# EAGLE design sensie (EAGLE 6.4)
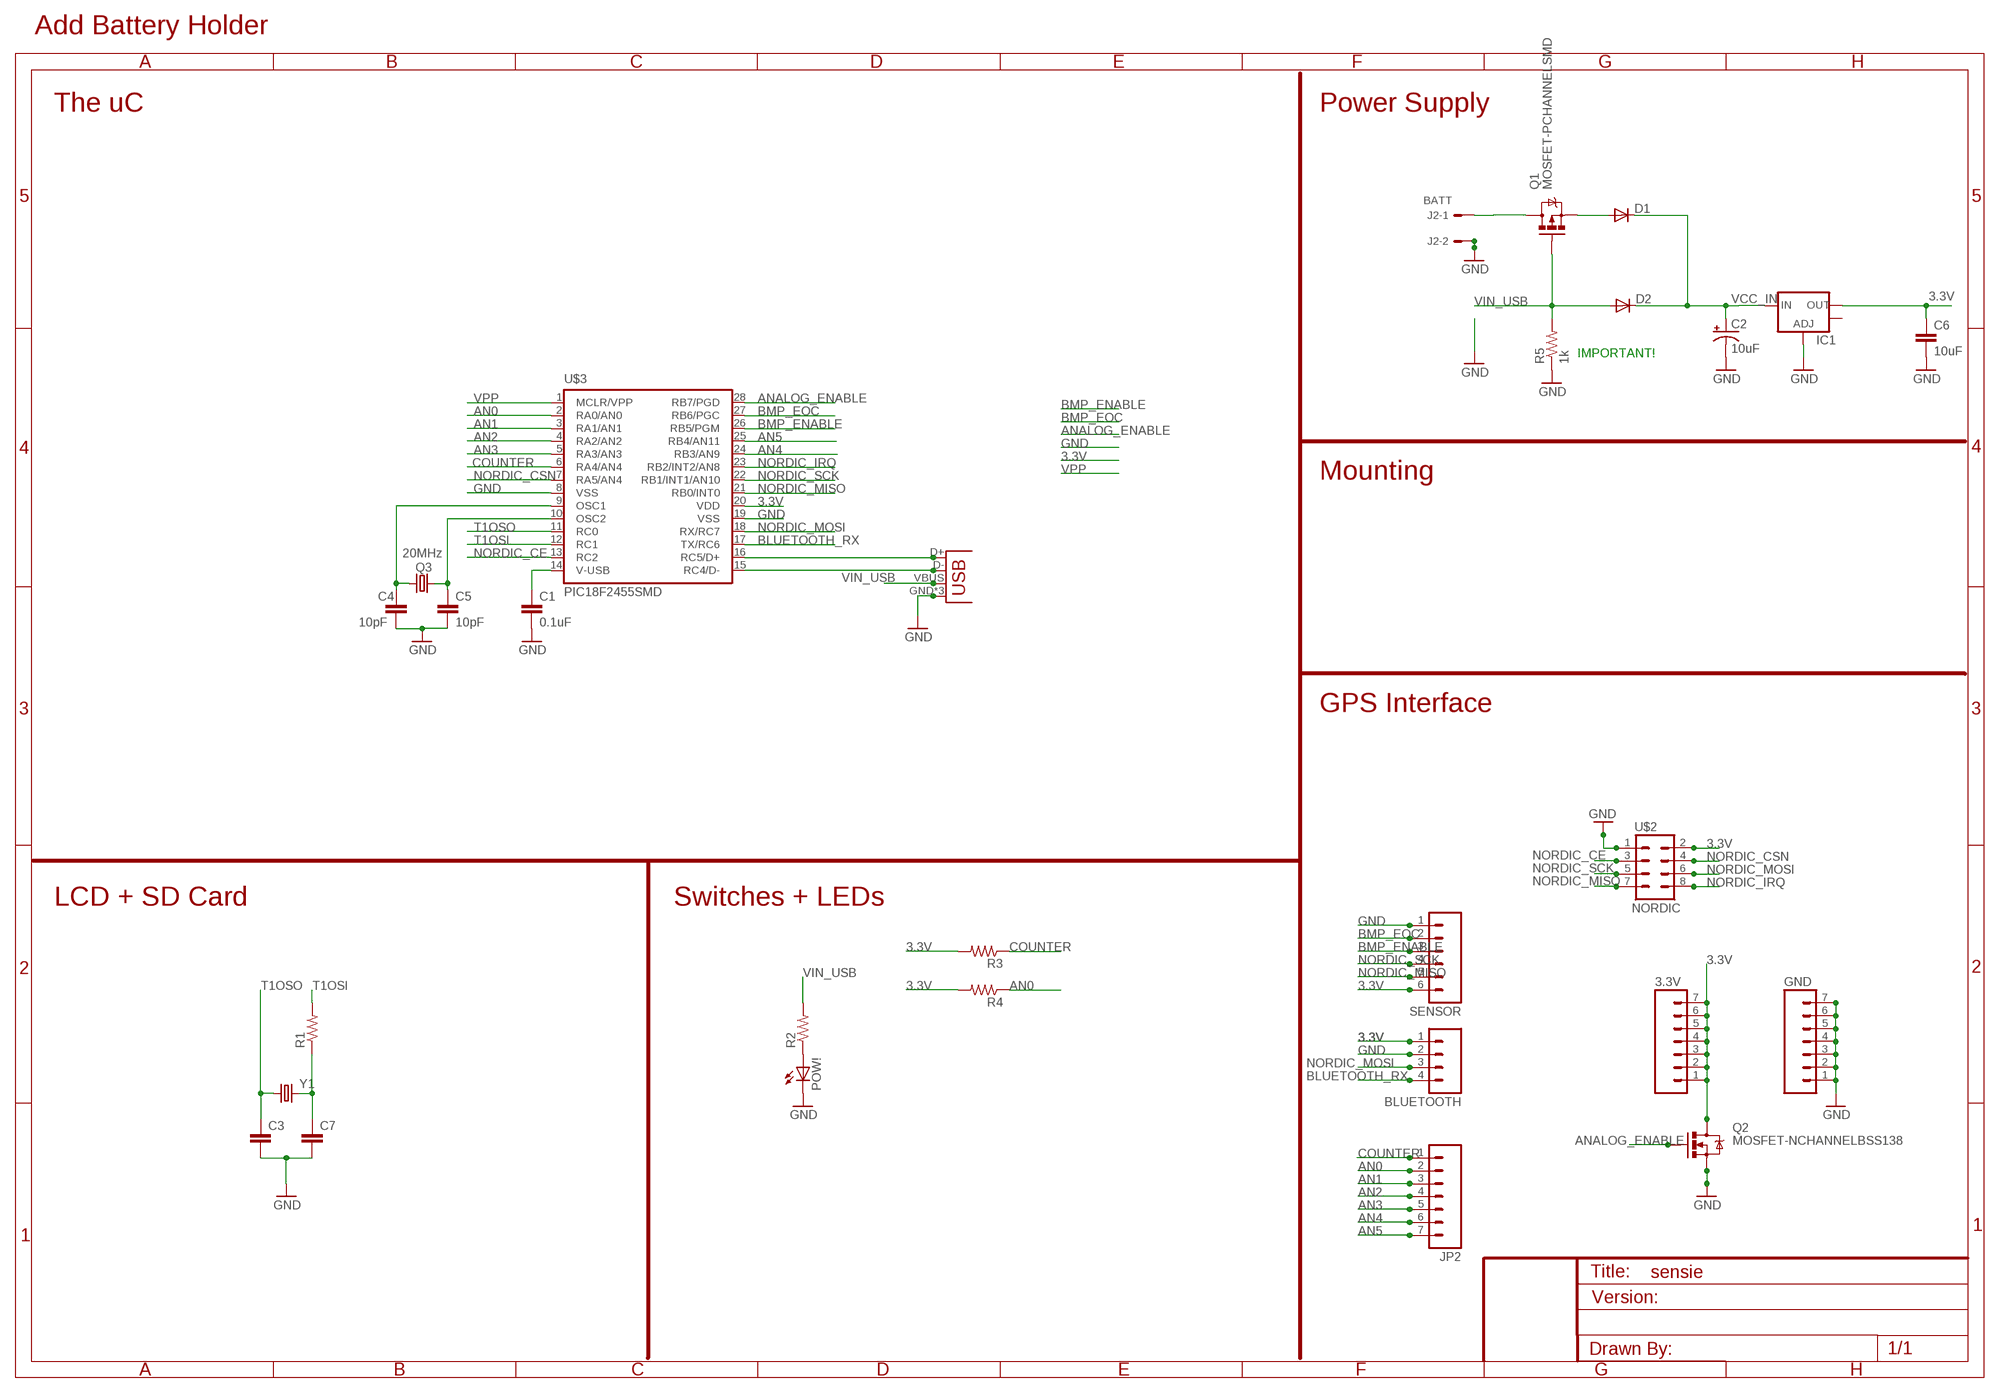
[diagram p0: schematic, sheet 1]

## Parts
3.3V  M07  [1X07]
BLUETOOTH  M04PTH  [1X04]
C1  0.1uF  CAP0805  [0805]
C2  10uF  CAP_POL3528  [EIA3528]
C3  CAP0603-CAP  [0603-CAP]
C4  10pF  CAP0805  [0805]
C5  10pF  CAP0805  [0805]
C6  10uF  CAPSMD  [GRM43D]
C7  CAP0603-CAP  [0603-CAP]
D1  DIODESOD  [SOD-323]
D2  DIODESOD  [SOD-323]
GND  M07  [1X07]
IC1  V_REG_LM1117SOT223  [SOT223]
J2  BATT  JST-PH-2-BS  [B2B-PH-K-S]
JP2  M07  [1X07]
JP3  USB-MICROB  [USB-MICROB]
POW!  LED0603  [LED-0603]
Q1  MOSFET-PCHANNELSMD  [SOT23-3]
Q2  MOSFET-NCHANNELBSS138  [SOT23]
Q3  20MHz  CRYSTALSMD  [HC49UP]
R1  RESISTOR0603-RES  [0603-RES]
R2  RESISTOR0603-RES  [0603-RES]
R3  RESISTOR0603-RES  [0603-RES]
R4  RESISTOR0603-RES  [0603-RES]
R5  1k  RESISTOR  [0805]
SENSOR  M06SIP  [1X06]
U$2  NORDIC  M04X2  [2X4]
U$3  PIC18F2455SMD  [SO-28W]
Y1  CRYSTAL32-SMD  [CRYSTAL-32KHZ-SMD]

## Nets
3.3V: 3.3V.1 3.3V.2 3.3V.3 3.3V.4 3.3V.5 3.3V.6 3.3V.7 BLUETOOTH.1 C6.A IC1.2(OUT) Q2.3(D) R3.2 R4.2 SENSOR.6 U$2.2 U$3.20(VDD)
AN0: JP2.2 R4.1 U$3.2(RA0/AN0)
AN1: JP2.3 U$3.3(RA1/AN1)
AN2: JP2.4 U$3.4(RA2/AN2)
AN3: JP2.5 U$3.5(RA3/AN3)
AN4: JP2.6 U$3.24(RB3/AN9)
AN5: JP2.7 U$3.25(RB4/AN11)
ANALOG_ENABLE: Q2.1(G) U$3.28(RB7/PGD)
BLUETOOTH_RX: BLUETOOTH.4 U$3.17(TX/RC6)
BMP_ENABLE: SENSOR.3 U$3.26(RB5/PGM)
BMP_EOC: SENSOR.2 U$3.27(RB6/PGC)
COUNTER: JP2.1 R3.1 U$3.6(RA4/AN4)
GND: BLUETOOTH.2 C1.2 C2.C(-) C3.2 C4.2 C5.2 C6.C C7.2 GND.1 GND.2 GND.3 GND.4 GND.5 GND.6 GND.7 IC1.1(ADJ) J2.2 JP3.GND JP3.P$3(GND) JP3.P$4(GND) POW!.C Q2.2(S) R5.1 SENSOR.1 U$2.1 U$3.8(VSS) U$3.19(VSS)
N$2: C1.1 U$3.14(V-USB)
N$3: POW!.A R2.1
N$8: C7.1 R1.1 Y1.X2
N$10: C5.1 Q3.2 U$3.10(OSC2)
N$11: C4.1 Q3.1 U$3.9(OSC1)
N$14: JP3.D+ U$3.16(RC5/D+)
N$15: JP3.D- U$3.15(RC4/D-)
N$19: D1.2(A) Q1.2(S)
NORDIC_CE: U$2.3 U$3.13(RC2)
NORDIC_CSN: U$2.4 U$3.7(RA5/AN4)
NORDIC_IRQ: U$2.8 U$3.23(RB2/INT2/AN8)
NORDIC_MISO: SENSOR.5 U$2.7 U$3.21(RB0/INT0)
NORDIC_MOSI: BLUETOOTH.3 U$2.6 U$3.18(RX/RC7)
NORDIC_SCK: SENSOR.4 U$2.5 U$3.22(RB1/INT1/AN10)
T1OSI: R1.2 U$3.12(RC1)
T1OSO: C3.1 U$3.11(RC0) Y1.X1
VCC_IN: C2.A(+) D1.1(C) D2.1(C) IC1.3(IN)
VIN_BATT: J2.1 Q1.3(D)
VIN_USB: D2.2(A) JP3.VBUS Q1.1(G) R2.2 R5.2
VPP: U$3.1(MCLR/VPP)
Unconnected: IC1.4(OUT)

## Notes on the sheet
- Add Battery Holder
- The uC | Power Supply
- IMPORTANT!
- Mounting
- GPS Interface
- LCD + SD Card | Switches + LEDs

## Library data of the parts
3.3V GND JP2 = SparkFun-Connectors:M07: Header 7 Standard 7-pin 0.1" header. Use with straight break away headers (SKU : PRT-00116), right angle break away headers (PRT-00553), swiss pins (PRT-00743), machine pins (PRT-00117), and female headers (PRT-00115). NOTES ON THE VARIANTS LOCK and LOCK_LONGPADS... This footprint was designed to help hold the alignment of a through-hole component (i.e. 7-pin header) while soldering it into place. You may notice that each hole has been shifted either up or down by 0.005 of an inch from it's more standard position (which is usually a perfectly straight line). This slight alteration caused the pins (the squares in the middle) to touch the edges of the holes. Because they are alternating, it causes a "brace" to hold the header in place. 0.005 has proven to be the perfect amount of "off-center" position when using our standard breakaway headers. Although looks a little odd when you look at the bare footprint, once you have a header in there, the alteration is very hard to notice. Also, if you push a header all the way into place, it is covered up entirely on the bottom side. This idea of altering the position of holes to aid alignment will be further integrated into the Sparkfun Library for other footprints. It can help hold any component with 3 or more connection pins.
BLUETOOTH = SparkFun-Connectors:M04: Header 4 Standard 4-pin 0.1" header. Use with straight break away headers (SKU : PRT-00116), right angle break away headers (PRT-00553), swiss pins (PRT-00743), machine pins (PRT-00117), and female headers (PRT-00115). Molex polarized connector foot print use with SKU : PRT-08231 with associated crimp pins and housings. 1MM SMD Version SKU: PRT-10208
C1 C4-C6 = SparkFun:CAP: Capacitor Standard 0603 ceramic capacitor, and 0.1" leaded capacitor.
C2 = SparkFun:CAP_POL: Capacitor Polarized These are standard SMD and PTH capacitors. Normally 10uF, 47uF, and 100uF in electrolytic and tantalum varieties. Always verify the external diameter of the through hole cap, it varies with capacity, voltage, and manufacturer. The EIA devices should be standard.
C3 C7 = SparkFun-Passives:CAP: Capacitor Standard 0603 ceramic capacitor, and 0.1" leaded capacitor.
D1 D2 = SparkFun-DiscreteSemi:DIODE: Diode These are standard reverse protection diodes and small signal diodes. SMA package can handle up to about 1A. SOD-323 can handle about 200mA. What the SOD-323 package when ordering, there are some mfgs out there that are 5-pin packages.
IC1 = SparkFun-PowerIC:V_REG_LM1117: Voltage Regulator LM1117 Standard adjustable voltage regulator but in SMD form. Spark Fun Electronics SKU : COM-00595
J2 = pcb_libraries_con-jst-ph:JST-PH-2
JP3 = bafoontecha:USB: USB Connectors USB-B-PTH is fully proven SKU : PRT-00139/CONN-08278 USB-miniB is fully proven SKU : PRT-00587 USB-A-PCB is untested. USB-A-H is throughly reviewed, but untested. Spark Fun Electronics SKU : PRT-00437 USB-B-SMT is throughly reviewed, but untested. Needs silkscreen touching up. USB-A-S has not been used/tested USB-MB-H has not been used/tested USB-MICROB has been used. CONN-09505; PROD_ID: CONN-09505
POW! = SparkFun-LED:LED: LEDs Standard schematic elements and footprints for 5mm, 3mm, 1206, and 0603 sized LEDs. 5mm - Spark Fun Electronics SKU : COM-00529 (and others)
Q1 = SparkFun-DiscreteSemi:MOSFET-PCHANNEL: Generic PMOSFET
Q2 = SparkFun-DiscreteSemi:MOSFET-NCHANNEL: Common NMOSFET Parts MFG P/N Store ID Prod ID FDD8780 TRANS-09984 SI7820DN TRANS-11055 FDS6630A IC-08089 2N7002PW TRANS-11151 FQP30N06L COM-10213 TRANS-10060 BSS123LT1G TRANS-08345 BSS138 TRANS-00830 BS170 2N7000; PROD_ID: TRANS-00830
Q3 = SparkFun:CRYSTAL: Crystals Various standard crystals. Proven footprints. Spark Fun Electronics SKU : COM-00534
R1-R4 = SparkFun-Passives:RESISTOR: Resistor
R5 = SparkFun:RESISTOR: Resistor
SENSOR = SparkFun-Connectors:M06: Header 6 Standard 6-pin 0.1" header. Use with straight break away headers (SKU : PRT-00116), right angle break away headers (PRT-00553), swiss pins (PRT-00743), machine pins (PRT-00117), and female headers (PRT-00115). Molex polarized connector foot print use with SKU : PRT-08094 with associated crimp pins and housings. NOTES ON THE VARIANTS LOCK and LOCK_LONGPADS... This footprint was designed to help hold the alignment of a through-hole component (i.e. 6-pin header) while soldering it into place. You may notice that each hole has been shifted either up or down by 0.005 of an inch from it's more standard position (which is a perfectly straight line). This slight alteration caused the pins (the squares in the middle) to touch the edges of the holes. Because they are alternating, it causes a "brace" to hold the component in place. 0.005 has proven to be the perfect amount of "off-center" position when using our standard breakaway headers. Although looks a little odd when you look at the bare footprint, once you have a header in there, the alteration is very hard to notice. Also,if you push a header all the way into place, it is covered up entirely on the bottom side. This idea of altering the position of holes to aid alignment will be further integrated into the Sparkfun Library for other footprints. It can help hold any component with 3 or more connection pins.
U$2 = SparkFun-Connectors:M04X2: .1" header, two rows of four.
U$3 = SparkFun:PIC18F2455
Y1 = SparkFun-FreqCtrl:CRYSTAL: Various standard crystals. Proven footprints. Spark Fun Electronics SKU : COM-00534

## Board
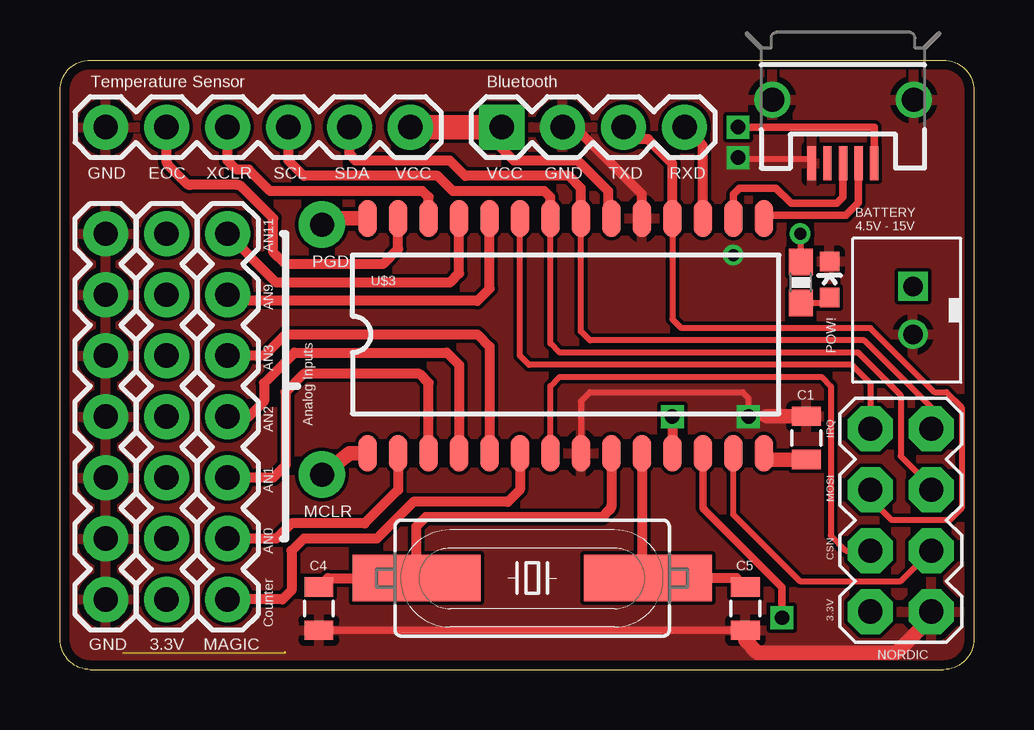
[diagram p1: board, top side]
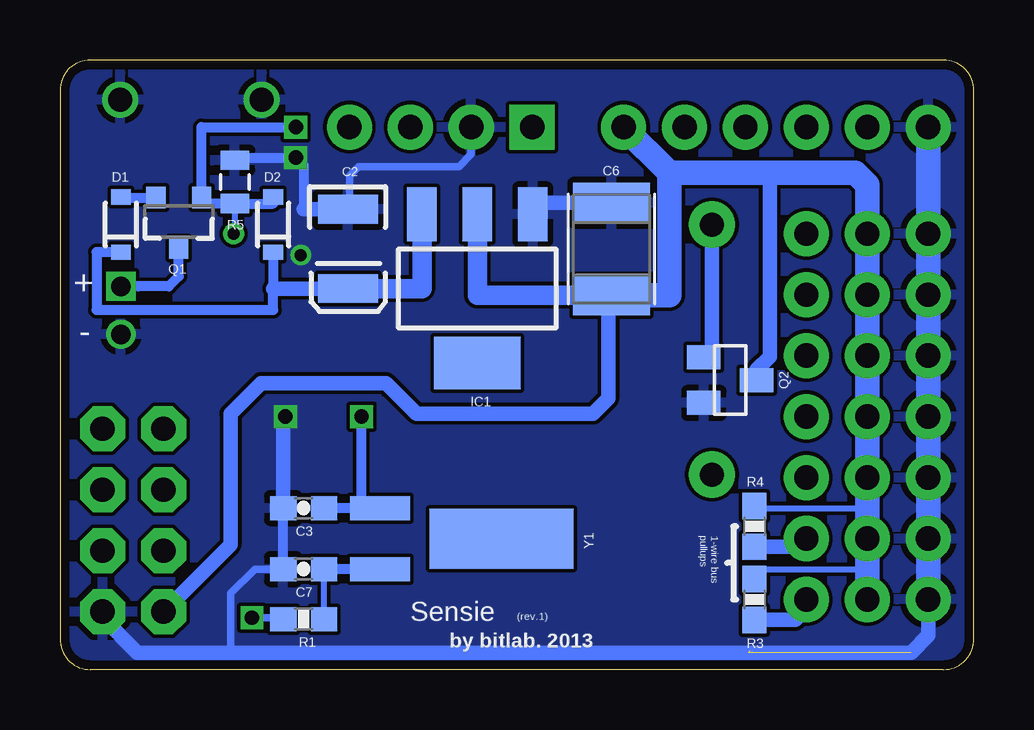
[diagram p2: board, bottom side, seen from below]

Size 38.1 x 25.4 mm. Coordinates in mm from the lower left corner, seen from the top.
Outline: 1.27,0 arc-90 0,1.27 0,24.13 arc-90 1.27,25.4 36.83,25.4 arc-90 38.1,24.13 38.1,1.27 arc-90 36.83,0 1.27,0
Copper layers (1*16): Top 0.0356mm / dielectric 1.5011mm / Bottom 0.0356mm
Design rules "LaenPCBOrder": minimum track width 6mil, minimum drill 13mil, track to track 6mil, track to pad 6mil, pad to pad 6mil, via to via 6mil, smd to smd 6mil, copper to edge 15mil, drill to drill 6mil, minimum pad ring 7mil, minimum via ring 7mil, stop-mask expansion 4mil, vias tented up to drill 0mil, thermal gap 10mil

### Footprints (pad centres in the part's own frame; a part is rotated, then mirrored left to right if it is on the bottom)
1X07 = drill 1.016 pad 1.88: 1 0,0; 2 2.54,0; 3 5.08,0; 4 7.62,0; 5 10.16,0; 6 12.7,0; 7 15.24,0
1X04 = drill 1.016 pad 1.88 square: 1 0,0 | drill 1.016 pad 1.88: 2 2.54,0; 3 5.08,0; 4 7.62,0
0805 = smd 0.8 x 1.2: 1 -0.9,0; 2 0.9,0
EIA3528 = smd 1.2 x 2.5: A 1.65,0; C -1.65,0
0603-CAP = smd 1.1 x 1: 1 -0.85,0; 2 0.85,0
GRM43D = smd 1.65 x 3.2: A 1.927,0; C -1.927,0
SOD-323 = smd 0.63 x 0.83: 1 -1.15,0; 2 1.15,0
SOT223 = smd 1.219 x 2.235: 1 -2.311,-3.099; 2 0,-3.099; 3 2.311,-3.099 | smd 3.6 x 2.2: 4 0,3.099
B2B-PH-K-S = drill 0.813 square: 1 2,0 | drill 0.813: 2 0,0
USB-MICROB = smd 0.35 x 1.4: D+ 0,2.65; D- -0.65,2.65; GND 1.3,2.65; ID 0.65,2.65; VBUS -1.3,2.65 | drill 1: P$3 -2.949,0; P$4 2.949,0
LED-0603 = smd 0.8 x 0.8: A 0,-0.75; C 0,0.75
SOT23-3 = smd 0.8 x 0.9: 1 -0.95,-1; 2 0.95,-1; 3 0,1.1
SOT23 = smd 1 x 1.4: 1 -0.95,-1.1; 2 0.95,-1.1; 3 0,1.1
HC49UP = smd 5.334 x 1.93: 1 -4.826,0; 2 4.826,0
0603-RES = smd 1.1 x 1: 1 -0.85,0; 2 0.85,0
1X06 = drill 1.016 pad 1.88: 1 0,0; 2 2.54,0; 3 5.08,0; 4 7.62,0; 5 10.16,0; 6 12.7,0
2X4 = drill 1.016 pad 1.88 octagon: 1 -3.81,-1.27; 2 -3.81,1.27; 3 -1.27,-1.27; 4 -1.27,1.27; 5 1.27,-1.27; 6 1.27,1.27; 7 3.81,-1.27; 8 3.81,1.27
SO-28W = smd 0.762 x 1.524: 1 -8.255,-4.953; 2 -6.985,-4.953; 3 -5.715,-4.953; 4 -4.445,-4.953; 5 -3.175,-4.953; 6 -1.905,-4.953; 7 -0.635,-4.953; 8 0.635,-4.953; 9 1.905,-4.953; 10 3.175,-4.953; 11 4.445,-4.953; 12 5.715,-4.953; 13 6.985,-4.953; 14 8.255,-4.953; 15 8.255,4.826; 16 6.985,4.826; 17 5.715,4.826; 18 4.445,4.826; 19 3.175,4.826; 20 1.905,4.826; 21 0.635,4.826; 22 -0.635,4.826; 23 -1.905,4.826; 24 -3.175,4.826; 25 -4.445,4.826; 26 -5.715,4.826; 27 -6.985,4.826; 28 -8.255,4.826
CRYSTAL-32KHZ-SMD = smd 2.5 x 6: SHEILD 0,5.08 | smd 1 x 2.5: X1 -1.27,0; X2 1.27,0

### Placement (x,y rotation side)
3.3V  4.45,2.92 90 top
BLUETOOTH  18.41,22.61 0 top
C1  31.11,9.65 90 top
C2  26.09,17.53 270 bottom
C3  27.94,6.73 180 bottom
C4  10.79,2.54 270 top
C5  28.57,2.54 270 top
C6  15.11,17.53 270 bottom
C7  27.94,4.19 180 bottom
D1  35.56,18.54 90 bottom
D2  29.21,18.54 90 bottom
GND  1.91,2.92 90 top
IC1  20.7,15.88 180 bottom
J2  35.56,13.97 90 top
JP2  6.99,2.92 90 top
JP3  32.64,23.75 180 top
POW!  32.08,16.26 0 top
Q1  33.15,18.67 180 bottom
Q2  10.16,12.06 270 bottom
Q3  19.68,3.81 0 top
R1  27.94,2.11 180 bottom
R2  30.89,16.13 90 top
R3  9.14,2.92 90 bottom
R4  9.14,5.97 90 bottom
R5  30.81,20.32 270 bottom
SENSOR  1.91,22.61 0 top
U$2  35.05,6.22 90 top
U$3  21.08,13.97 0 top
Y1  24.77,5.46 270 bottom

### Tracks (layer width: path | path; a pad name or v marks a point on that pad's centre or on a via)
3.3V
  Top 0.406: U$3.20 22.99,18.92 22.86,19.05 22.86,19.94 21.59,21.21 18.92,21.21 18.41,21.72 BLUETOOTH.1
  Top 1.016: BLUETOOTH.1 SENSOR.6
  Bottom 0.254: R3.2 arc90 8.98,4.19 4.45,4.19 | R4.2 9.31,6.73 4.45,6.73
  Bottom 0.61: 8.51,20.7 8.51,13.04 9.06,12.49 Q2.3 | 20.7,15.6 15.6,15.6 15.24,15.24 15.24,11.3 15.88,10.67 23.24,10.67 24.51,11.94 29.72,11.94 30.99,10.67 30.99,5.21 U$2.2
  Bottom 0.813: C6.A 20.7,15.6 IC1.2
  Bottom 1.016: 3.3V.1 4.45,4.19 3.3V.2 4.45,6.73 3.3V.3 3.3V.4 3.3V.5 3.3V.6 3.3V.7 4.45,20.19 4.95,20.7 8.51,20.7 12.7,20.7 | 12.7,20.7 12.7,15.6 C6.A | 12.7,20.7 SENSOR.6
AN0
  Top 0.406: U$3.2 14.1,7.49 12.7,6.1 9.65,6.1 9.02,5.46 JP2.2
  Bottom 0.61: R4.1 7.33,5.12 JP2.2
AN1
  Top 0.406: U$3.3 15.37,11.94 14.99,12.32 10.16,12.32 9.4,11.56 9.4,8.51 8.89,8 JP2.3
AN2
  Top 0.406: U$3.4 16.64,12.7 16.13,13.21 9.78,13.21 8.51,11.94 8.51,11.18 7.87,10.54 JP2.4
AN3
  Top 0.406: U$3.5 17.91,13.46 17.4,13.97 9.4,13.97 8.51,13.08 JP2.5
AN4
  Top 0.406: U$3.24 17.91,15.88 17.4,15.37 7.24,15.37 JP2.6
AN5
  Top 0.406: U$3.25 16.64,16.51 16.26,16.13 9.02,16.13 JP2.7
ANALOG_ENABLE  (via drill 1 pad 1.93)
  Top 0.61: U$3.28 11.43,18.8 v10.92,18.54
  Bottom 0.61: Q2.1 10.92,13.35 v10.92,18.54
BLUETOOTH_RX
  Top 0.406: U$3.17 26.8,21.84 BLUETOOTH.4
BMP_ENABLE
  Top 0.406: U$3.26 15.37,19.68 15.11,19.94 8.76,19.94 7.87,20.83 7.37,20.83 6.99,21.21 SENSOR.3
BMP_EOC
  Top 0.406: SENSOR.2 4.45,21.19 arc45 4.52,21.01 5.26,20.27 arc45 5.44,20.19 7.39,20.19 arc-45 7.57,20.12 8.89,18.8 8.89,17.4 9.4,16.89 13.46,16.89 14.1,17.53 U$3.27
COUNTER
  Top 0.406: JP2.1 9.27,2.92 9.65,3.3 9.65,4.95 10.16,5.46 13.21,5.46 14.73,6.99 18.67,6.99 19.18,7.49 U$3.6
  Bottom 0.61: R3.1 7.45,2.07 7.11,2.41 7.11,2.79 JP2.1
GND  (via drill 0.5 pad 0.3, 0.6)  (2 unrouted)
  Top 0.254: v28.27,21.34 28.63,21.29 31.34,21.29 JP3.GND | v28.7,10.54 28.7,11.3 28.45,11.56 22.1,11.56 21.72,11.18 U$3.8
  Top 0.305: C4.2 C5.2
  Top 0.406: U$3.19 24.26,19.81 21.46,22.61 BLUETOOTH.2 | C1.2 28.83,10.55 v28.7,10.54
  Top 0.61: C5.2 28.57,1.22 29.08,0.71 34.87,0.71 36.32,2.16 U$2.1 | C1.2 29.48,10.55
  Bottom 0.305: C7.2 29.97,4.19 30.99,3.17 30.99,0.71 30.86,0.84 | BLUETOOTH.2 20.95,21.46 21.46,20.95 25.65,20.95 26.04,20.57 26.04,19.23 C2.C
  Bottom 0.406: C7.2 C3.2 | R5.1 30.62,21.34 v28.27,21.34 27.94,21.01 27.94,19.18
  Bottom 0.61: C2.C 27.94,19.18 | GND.1 1.91,1.42 2.62,0.71 30.99,0.71 34.87,0.71 36.32,2.16 U$2.1 | C3.2 28.79,10.38 v28.7,10.54 | IC1.1 18.39,19.45 C6.C
  Bottom 1.016: GND.2 GND.1 | GND.2 GND.3 | GND.2 GND.4 GND.5 GND.6 GND.7 SENSOR.1
  other vias: 28.07,17.27
  pour Top: 2.54,25.4 36.83,25.4 arc-90 38.1,24.13 38.1,1.27 arc-90 36.83,0 1.27,0 arc-90 0,1.27 0,24.13 arc-90 1.27,25.4
  pour Bottom: 1.27,25.4 36.83,25.4 arc-90 38.1,24.13 38.1,1.27 arc-90 36.83,0 1.27,0 arc-90 0,1.27 0,24.13 arc-90
N$2
  Top 0.406: U$3.14 29.51,9.19
  Top 0.61: C1.1 29.6,8.75 arc-90 U$3.14
N$3
  Top 0.254: R2.1 31.85,15.28 POW!.A
N$8
  Bottom 0.254: R1.1 C7.1
  Bottom 0.406: Y1.X2 C7.1
N$10
  Top 0.406: C5.1 28.2,3.81 Q3.2 arc-90 24.26,4.06 U$3.10
N$11
  Top 0.406: C4.1 11.16,3.81 Q3.1 14.86,5.97 15.24,6.35 22.61,6.35 22.91,6.66 arc45 22.99,6.84 U$3.9
N$14
  Top 0.305: U$3.16 28.07,19.81 28.32,20.07 29.84,20.07 30.48,19.43 32.38,19.43 32.64,19.68 JP3.D+
N$15
  Top 0.305: U$3.15 arc-90 29.46,18.92 32.77,18.92 33.29,19.45 JP3.D-
N$19
  Bottom 0.406: D1.2 35.31,19.67 Q1.2
NORDIC_CE
  Top 0.254: U$3.13 28.07,6.46 30.84,3.68 35.05,3.68 U$2.3
NORDIC_CSN
  Top 0.254: U$3.7 20.45,11.81 20.83,12.19 31.75,12.19 32.13,11.81 32.13,5.59 32.77,4.95 U$2.4
NORDIC_IRQ
  Top 0.254: U$3.23 19.18,13.08 19.56,12.7 33.02,12.7 33.78,11.94 U$2.8
NORDIC_MISO
  Top 0.254: U$3.21 21.72,14.1 22.1,13.72 33.53,13.72 36.32,10.92 U$2.7
  Top 0.406: 12.06,22.23 SENSOR.5 12.06,21.46 12.32,21.21 16.26,21.21 16.89,20.57 21.21,20.57 21.72,20.07 U$3.21
NORDIC_MOSI
  Top 0.254: U$3.18 25.53,14.61 25.91,14.22 33.78,14.22 36.45,11.56 36.96,11.56 37.59,10.92 37.59,6.73 37.08,6.22 34.67,6.22 33.78,7.11 U$2.6
  Top 0.406: U$3.18 25.53,21.08 24.51,22.1 24,22.1 BLUETOOTH.3
NORDIC_SCK
  Top 0.254: U$3.22 20.45,13.59 20.83,13.21 33.27,13.21 35.05,11.43 35.05,8.89 36.32,7.62 U$2.5
  Top 0.406: 9.53,22.23 SENSOR.4 9.53,21.21 10.16,20.57 15.75,20.57 16.38,19.94 20.19,19.94 20.45,19.68 U$3.22
T1OSI  (via drill 0.6)
  Top 0.305: U$3.12 26.8,6.84 arc45 26.87,6.66 30.1,3.43 v30.1,2.16
  Bottom 0.305: R1.2 28.84,2.16 v30.1,2.16
T1OSO  (via drill 0.6)
  Top 0.406: v25.53,10.54 U$3.11
  Bottom 0.406: C3.1 Y1.X1 25.53,6.73 v25.53,10.54
VCC_IN
  Bottom 0.406: D1.1 36.58,17.39 36.58,14.99 29.21,14.99 29.21,15.88 D2.1
  Bottom 0.61: C2.A 27.43,15.88 29.21,15.88
  Bottom 0.813: IC1.3 23.01,15.88 C2.A
VIN_BATT
  Bottom 0.406: 34.83,15.97 J2.1 33.56,15.97 33.15,16.38 Q1.3
VIN_USB  (via drill 0.5 pad 0.3, 0.6)
  Top 0.254: v30.86,18.16 30.86,17 R2.2
  Top 0.305: 33.94,20.83 JP3.VBUS 33.94,22.61 v28.27,22.61
  Bottom 0.254: R5.2 30.81,18.21 v30.86,18.16
  Bottom 0.406: D2.2 29.21,19.42 R5.2 31.94,19.42 Q1.1 32.2,22.61 v28.27,22.61
VPP  (via drill 1 pad 1.93)
  Top 0.61: U$3.1 12.06,9.02 v10.92,8.13

### Text on the board
tNames: Temperature Sensor | Bluetooth | GND | EOC | XCLR | SCL | SDA | VCC | VCC | GND | TXD | RXD | BATTERY / 4.5V - 15V | AN11 | PGD | AN9 | AN3 | AN2 | Analog Inputs | IRQ | AN1 | MCLR | MOSI | AN0 | CSN | Counter | 3.3V | MAGIC
bNames: + | - | 1-wire bus / pullups | by bitlab. 2013 | (rev.1) | Sensie